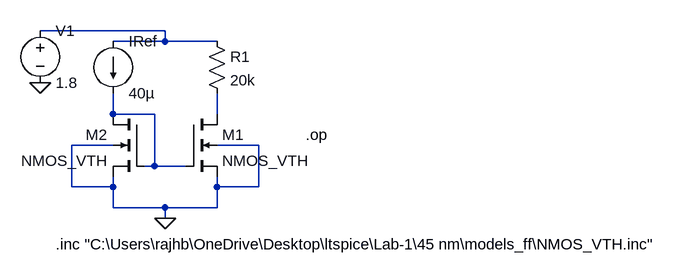
[diagram p0: schematic Exp_5_current_mirror.asc]
Exp_5_current_mirror.asc, the LTspice schematic file:
Version 4
SHEET 1 1088 680
WIRE 208 64 16 64
WIRE 208 80 208 64
WIRE 208 80 128 80
WIRE 288 80 208 80
WIRE 128 192 128 160
WIRE 192 192 128 192
WIRE 288 192 288 160
WIRE 128 240 64 240
WIRE 352 240 288 240
WIRE 192 272 192 192
WIRE 192 272 176 272
WIRE 240 272 192 272
WIRE 64 304 64 240
WIRE 128 304 128 288
WIRE 128 304 64 304
WIRE 288 304 288 288
WIRE 352 304 352 240
WIRE 352 304 288 304
WIRE 128 336 128 304
WIRE 208 336 128 336
WIRE 288 336 288 304
WIRE 288 336 208 336
WIRE 208 352 208 336
FLAG 208 352 0
FLAG 16 144 0
SYMBOL current 128 80 R0
WINDOW 123 0 0 Left 0
WINDOW 39 0 0 Left 0
SYMATTR InstName IRef
SYMATTR Value 40µ
SYMBOL nmos4 240 192 R0
SYMATTR InstName M1
SYMATTR Value NMOS_VTH
SYMATTR Value2 l=50n w=1u
SYMBOL nmos4 176 192 M0
SYMATTR InstName M2
SYMATTR Value NMOS_VTH
SYMATTR Value2 l=100n w=1u
SYMBOL res 272 64 R0
SYMATTR InstName R1
SYMATTR Value 20k
SYMBOL voltage 16 48 R0
WINDOW 123 0 0 Left 0
WINDOW 39 0 0 Left 0
SYMATTR InstName V1
SYMATTR Value 1.8
TEXT 40 392 Left 2 !.inc "C:\\Users\\rajhb\\OneDrive\\Desktop\\ltspice\\Lab-1\\45 nm\\models_ff\\NMOS_VTH.inc"
TEXT 424 224 Left 2 !.op

The netlist it stands for:
* Exp_5_current_mirror.asc
IRef N001 N002 40µ
M1 N003 N002 0 0 NMOS_VTH l=50n w=1u
M2 N002 N002 0 0 NMOS_VTH l=100n w=1u
R1 N001 N003 20k
V1 N001 0 1.8
.model NMOS NMOS
.model PMOS PMOS
.lib standard.mos
.inc "C:\Users\rajhb\OneDrive\Desktop\ltspice\Lab-1\45 nm\models_ff\NMOS_VTH.inc"
.op
.backanno
.end